# Altium project MCU_Board.PrjPcb
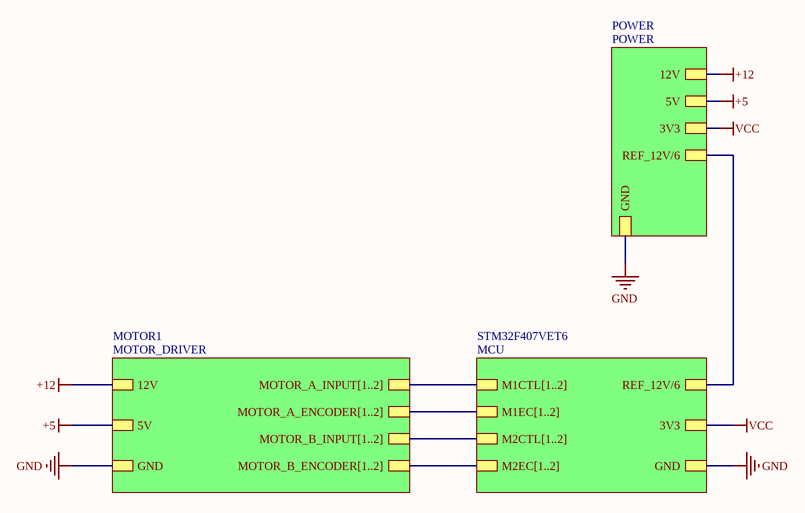
[diagram p0: TOP.SchDoc]
4 sheets, 67 parts. Net scope: hierarchical (ports join the sheet entries above them; power ports are global).
Board file: PCB1.PcbDoc
Sheets:
  TOP.SchDoc
    POWER = POWER.SchDoc
    STM32F407VET6 = MCU.SchDoc
    MOTOR1 = MOTOR_DRIVER.SchDoc

## Sheet TOP.SchDoc
size A4; SheetNumber: 1; SheetTotal: 4

### Sub-sheets
MOTOR1 = MOTOR_DRIVER: 12V, GND, MOTOR_A_INPUT[1..2], MOTOR_A_ENCODER[1..2], 5V, MOTOR_B_ENCODER[1..2], MOTOR_B_INPUT[1..2]
POWER = POWER: 12V, 5V, 3V3, GND, REF_12V/6
STM32F407VET6 = MCU: 3V3, GND, M1CTL[1..2], M1EC[1..2], M2CTL[1..2], M2EC[1..2], REF_12V/6

### Nets
+5: sheet POWER/5V, sheet MOTOR1/5V
+12: sheet POWER/12V, sheet MOTOR1/12V
GND: sheet POWER/GND, sheet STM32F407VET6/GND, sheet MOTOR1/GND
VCC: sheet POWER/3V3, sheet STM32F407VET6/3V3
REF_12V/6: sheet POWER/REF_12V/6, sheet STM32F407VET6/REF_12V/6

### Buses and harness runs
bus sheet MOTOR1/MOTOR_A_ENCODER[1..2] = sheet STM32F407VET6/M1EC[1..2]
bus sheet MOTOR1/MOTOR_A_INPUT[1..2] = sheet STM32F407VET6/M1CTL[1..2]
bus sheet MOTOR1/MOTOR_B_ENCODER[1..2] = sheet STM32F407VET6/M2EC[1..2]
bus sheet MOTOR1/MOTOR_B_INPUT[1..2] = sheet STM32F407VET6/M2CTL[1..2]

## Sheet POWER.SchDoc
size 203 x 127 mm; SheetNumber: 2; SheetTotal: 4
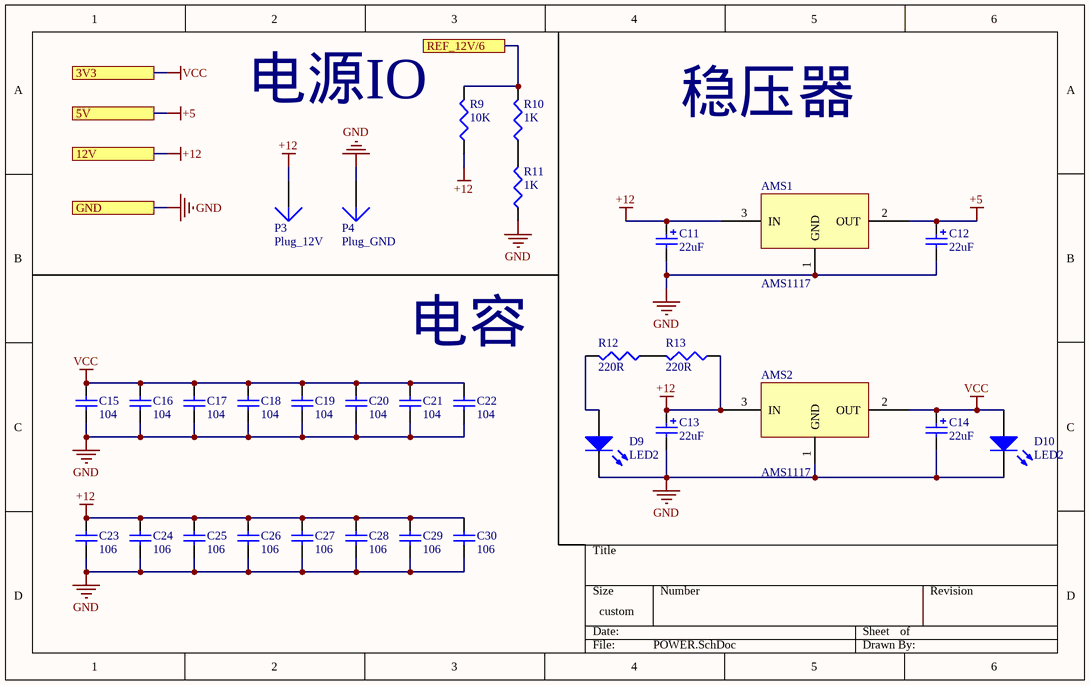
[diagram p1: POWER.SchDoc]

### Parts
AMS1  AMS1117  [AMS1117]
AMS2  AMS1117  [AMS1117]
C11  22uF  [MY0805]
C12  22uF  [MY0805]
C13  22uF  [MY0805]
C14  22uF  [MY0805]
C15  104  [MY0805]
C16  104  [MY0805]
C17  104  [MY0805]
C18  104  [MY0805]
C19  104  [MY0805]
C20  104  [MY0805]
C21  104  [MY0805]
C22  104  [MY0805]
C23  106  [MY0805]
C24  106  [MY0805]
C25  106  [MY0805]
C26  106  [MY0805]
C27  106  [MY0805]
C28  106  [MY0805]
C29  106  [MY0805]
C30  106  [MY0805]
D9  LED2  [MY0805]
D10  LED2  [MY0805]
P3  Plug_12V  [Hole_3MM]
P4  Plug_GND  [Hole_3MM]
R9  10K  [MY0805]
R10  1K  [MY0805]
R11  1K  [MY0805]
R12  220R  [MY0805]
R13  220R  [MY0805]

### Ports
3V3, 5V, 12V, GND, REF_12V/6

### Nets
+5: AMS1.2(OUT) C12.1 ; port 5V
+12: AMS1.3(IN) AMS2.3(IN) C11.1 C13.1 C23.2 C24.2 C25.2 C26.2 C27.2 C28.2 C29.2 C30.2 P3.1 R9.1 R13.1 ; port 12V
GND: AMS1.1(GND) AMS2.1(GND) C11.2 C12.2 C13.2 C14.2 C15.1 C16.1 C17.1 C18.1 C19.1 C20.1 C21.1 C22.1 C23.1 C24.1 C25.1 C26.1 C27.1 C28.1 C29.1 C30.1 D9.2(K) D10.2(K) P4.1 R11.1 ; port GND
VCC: AMS2.2(OUT) C14.1 C15.2 C16.2 C17.2 C18.2 C19.2 C20.2 C21.2 C22.2 D10.1(A) ; port 3V3
REF_12V/6: R9.2 R10.2 ; port REF_12V/6
NetD9_1: D9.1(A) R12.2
NetR10_1: R10.1 R11.2
NetR12_1: R12.1 R13.2

### Notes on the sheet
- 电源IO
- 稳压器
- 电容

### Library data of the parts
C11-C14 = Cap Pol2: Polarized Capacitor (Axial); Published: 8-Jun-2000; LatestRevisionDate: 17-Jul-2002; LatestRevisionNote: Re-released for DXP Platform.; PackageReference: POLAR0.8; Publisher: Altium Limited; PackageDescription: Polarized Capacitor; 2 Leads; Value: 22uF
C15-C30 = Cap: Capacitor; Published: 8-Jun-2000; LatestRevisionDate: 17-Jul-2002; LatestRevisionNote: Re-released for DXP Platform.; PackageReference: RAD-0.3; Publisher: Altium Limited; PackageDescription: Radial Cap, Thru-Hole; 2 Leads; 0.3 in Pin Spacing
  C15-C22: Value: 104
  C23-C30: Value: 106
D9 D10 = LED2: Typical RED, GREEN, YELLOW, AMBER GaAs LED; Published: 8-Jun-2000; LatestRevisionDate: 17-Jul-2002; LatestRevisionNote: Re-released for DXP Platform.; PackageVersion: Feb-2002; PackageReference: 3.2X1.6X1.1; Publisher: Altium Limited; PackageDescription: SM LED; 2 Flat Leads
P3 P4 = Plug: LatestRevisionDate: 17-Jul-2002; LatestRevisionNote: Re-released for DXP Platform.; Publisher: Altium Limited
R9-R11 = Res3: Resistor; Published: 8-Jun-2000; LatestRevisionDate: 29-May-2009; LatestRevisionNote: IPC-7351 Footprint Added.; PackageReference: J1-0603; Publisher: Altium Limited; PackageDescription: Chip Resistor
  R9: Value: 10K
  R10 R11: Value: 1K
R12 R13 = Res3: Resistor; Value: 1K; Published: 8-Jun-2000; LatestRevisionDate: 29-May-2009; LatestRevisionNote: IPC-7351 Footprint Added.; PackageReference: J1-0603; Publisher: Altium Limited; PackageDescription: Chip Resistor

## Sheet MCU.SchDoc
size A4; SheetNumber: 4; SheetTotal: 4
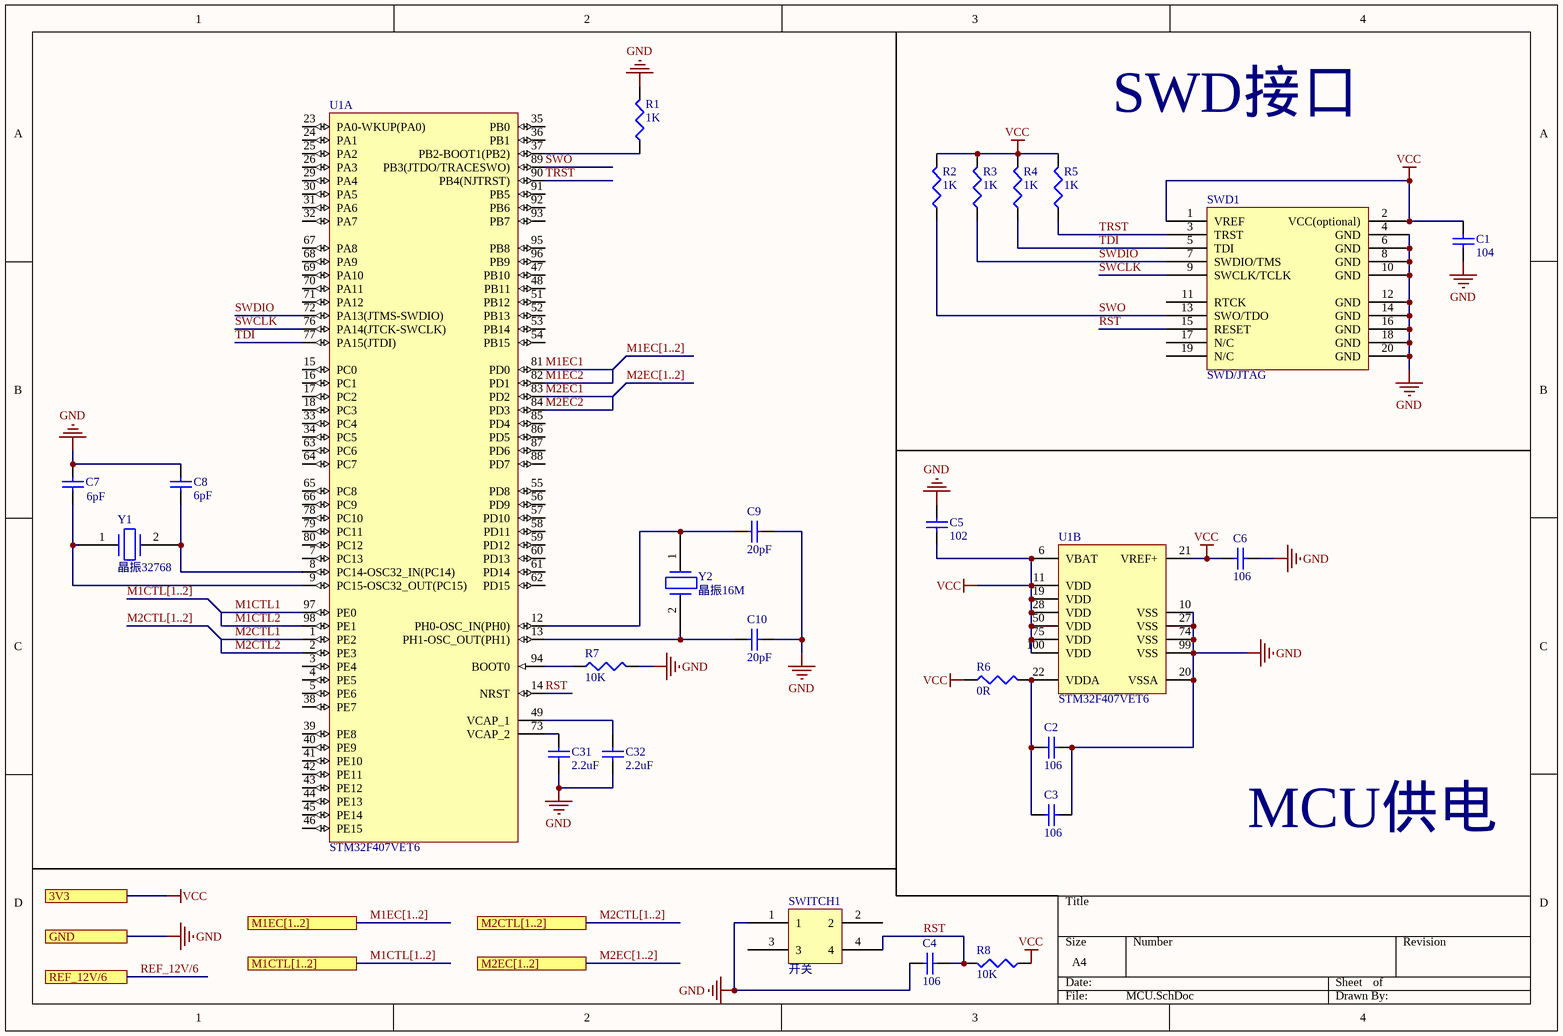
[diagram p2: MCU.SchDoc]

### Parts
C1  104  [MY0805]
C2  106  [MY0805]
C3  106  [MY0805]
C4  106  [MY0805]
C5  102  [MY0805]
C6  106  [MY0805]
C7  6pF  [MY0805]
C8  6pF  [MY0805]
C9  20pF  [MY0805]
C10  20pF  [MY0805]
C31  2.2uF  [MY0805]
C32  2.2uF  [MY0805]
R1  1K  [MY0805]
R2  1K  [MY0805]
R3  1K  [MY0805]
R4  1K  [MY0805]
R5  1K  [MY0805]
R6  0R  [MY0805]
R7  10K  [MY0805]
R8  10K  [MY0805]
SWD1  SWD/JTAG  [SWD]
SWITCH1  开关  [开关]
U1  STM32F407VET6  [STM-LQFP100_N]  (parts A,B of 2)
Y1  晶振32768  [晶振32768K_AT38]
Y2  晶振16M  [晶振16M]

### Ports
3V3, GND, M1CTL[1..2], M1EC[1..2], M2CTL[1..2], M2EC[1..2], REF_12V/6

### Nets
GND: C1.1 C2.2 C3.2 C4.1 C5.1 C6.2 C7.2 C8.2 C9.2 C10.2 C31.1 C32.1 R1.2 R7.2 SWD1.4(GND) SWD1.6(GND) SWD1.8(GND) SWD1.10(GND) SWD1.12(GND) SWD1.14(GND) SWD1.16(GND) SWD1.18(GND) SWD1.20(GND) SWITCH1.1 U1.10(VSS) U1.20(VSSA) U1.27(VSS) U1.74(VSS) U1.99(VSS) ; port GND
VCC: C1.2 C5.2 C6.1 R2.2 R3.2 R4.2 R5.2 R6.1 R8.1 SWD1.1(VREF) SWD1.2(VCC(optional)) U1.6(VBAT) U1.11(VDD) U1.19(VDD) U1.21(VREF+) U1.28(VDD) U1.50(VDD) U1.75(VDD) U1.100(VDD) ; port 3V3
M1CTL1: U1.97(PE0)
M1CTL2: U1.98(PE1)
M1EC1: U1.81(PD0)
M1EC2: U1.82(PD1)
M2CTL1: U1.1(PE2)
M2CTL2: U1.2(PE3)
M2EC1: U1.83(PD2)
M2EC2: U1.84(PD3)
RST: C4.2 R8.2 SWD1.15(RESET) SWITCH1.4 U1.14(NRST)
SWCLK: SWD1.9(SWCLK/TCLK) U1.76(PA14(JTCK-SWCLK))
SWDIO: R3.1 SWD1.7(SWDIO/TMS) U1.72(PA13(JTMS-SWDIO))
SWO: R2.1 SWD1.13(SWO/TDO) U1.89(PB3(JTDO/TRACESWO))
TDI: R4.1 SWD1.5(TDI) U1.77(PA15(JTDI))
TRST: R5.1 SWD1.3(TRST) U1.90(PB4(NJTRST))
NetC2_1: C2.1 C3.1 R6.2 U1.22(VDDA)
NetC7_1: C7.1 U1.9(PC15-OSC32_OUT(PC15)) Y1.1
NetC8_1: C8.1 U1.8(PC14-OSC32_IN(PC14)) Y1.2
NetC9_1: C9.1 U1.12(PH0-OSC_IN(PH0)) Y2.1
NetC10_1: C10.1 U1.13(PH1-OSC_OUT(PH1)) Y2.2
NetC31_2: C31.2 U1.73(VCAP_2)
NetC32_2: C32.2 U1.49(VCAP_1)
NetR1_1: R1.1 U1.37(PB2-BOOT1(PB2))
NetR7_1: R7.1 U1.94(BOOT0)

Not connected (* = marked no-connect by the designer): SWD1 11(RTCK) 17(N/C) 19(N/C); SWITCH1 2 3; U1 3(PE4) 4(PE5) 5(PE6) 7(PC13) 15(PC0) 16(PC1) 17(PC2) 18(PC3) 23(PA0-WKUP(PA0)) 24(PA1) 25(PA2) 26(PA3) 29(PA4) 30(PA5) 31(PA6) 32(PA7) 33(PC4) 34(PC5) 35(PB0) 36(PB1) 38(PE7) 39(PE8) 40(PE9) 41(PE10) 42(PE11) 43(PE12) 44(PE13) 45(PE14) 46(PE15) 47(PB10) 48(PB11) 51(PB12) 52(PB13) 53(PB14) 54(PB15) 55(PD8) 56(PD9) 57(PD10) 58(PD11) 59(PD12) 60(PD13) 61(PD14) 62(PD15) 63(PC6) 64(PC7) 65(PC8) 66(PC9) 67(PA8) 68(PA9) 69(PA10) 70(PA11) 71(PA12) 78(PC10) 79(PC11) 80(PC12) 85(PD4) 86(PD5) 87(PD6) 88(PD7) 91(PB5) 92(PB6) 93(PB7) 95(PB8) 96(PB9)

### Buses and harness runs
bus M1CTL[1..2]
bus M1CTL[1..2] = port M1CTL[1..2]
bus M1EC[1..2]
bus M1EC[1..2] = port M1EC[1..2]
bus M2CTL[1..2]
bus M2CTL[1..2] = port M2CTL[1..2]
bus M2EC[1..2]
bus M2EC[1..2] = port M2EC[1..2]

### Notes on the sheet
- SWD接口
- MCU供电

### Library data of the parts
C1-C6 C9 C10 C31 C32 = Cap: Capacitor; Published: 8-Jun-2000; LatestRevisionDate: 17-Jul-2002; LatestRevisionNote: Re-released for DXP Platform.; PackageReference: RAD-0.3; Publisher: Altium Limited; PackageDescription: Radial Cap, Thru-Hole; 2 Leads; 0.3 in Pin Spacing
  C1: Value: 104
  C2-C4 C6: Value: 106
  C5: Value: 102
  C9 C10: Value: 20PF
  C31 C32: Value: 2.2uF
C7 C8 = Cap: Capacitor; Value: 20PF; Published: 8-Jun-2000; LatestRevisionDate: 17-Jul-2002; LatestRevisionNote: Re-released for DXP Platform.; PackageReference: RAD-0.3; Publisher: Altium Limited; PackageDescription: Radial Cap, Thru-Hole; 2 Leads; 0.3 in Pin Spacing
R1-R8 = Res3: Resistor; Published: 8-Jun-2000; LatestRevisionDate: 29-May-2009; LatestRevisionNote: IPC-7351 Footprint Added.; PackageReference: J1-0603; Publisher: Altium Limited; PackageDescription: Chip Resistor
  R1-R5: Value: 1K
  R6: Value: 0R
  R7 R8: Value: 10K
U1 = STM32F407VET6: ARM Cortex-M4 32-bit MCU+FPU, 210 DMIPS, 512 kB Flash, 192 kB Internal RAM, 82 I/Os, 100-pin LQFP, -40 to 85 degC, Tray; Manufacturer: STMicroelectronics; D/A Converter: 2x12-bit; FLASH Size (Prog) (kB): 512; I/Os (High Current): 82; Internal RAM Size (kB): 192; Operating Frequency(F) (Processor speed) (MHz): 168; Supply Voltage(Vcc) max (V): 3.6; Supply Voltage(Vcc) min (V): 1.8; DatasheetVersion: Rev. 4; PackageVersion: Rev. 1, 06/2013; PackageReference: LQFP100; PackageDescription: 100-Pin Low Profile Quad Flat Package, 14 x 14 mm Body, 0.5 mm Pitch; Supplier 1: Digi-Key; Supplier Part Number 1: 497-12075-ND; Supplier 2: Farnell; Supplier Part Number 2: 2064367; Supplier 3: Newark; Supplier Part Number 3: 73T2332; Supplier 4: Mouser; Supplier Part Number 4: 511-STM32F407VET6; Core: ARM Cortex-M4; Packing: Tray; Mounting Technology: Surface Mount; PartNumber: STM32F407VET6; ComponentLink1Description: Manufacturer URL; ComponentLink1URL: http://www.st.com/web/en/home.html; ComponentLink2Description: Datasheet; ComponentLink2URL: http://www.st.com/st-web-ui/static/active/en/resource/technical/document/datasheet/DM00037051.pdf; ComponentLink3Description: Package Specification; ComponentLink3URL: http://www.st.com/st-web-ui/static/active/en/resource/technical/document/data_brief/DM00071938.pdf
Y1 Y2 = 晶振

## Sheet MOTOR_DRIVER.SchDoc
size A4; SheetNumber: 3; SheetTotal: 4
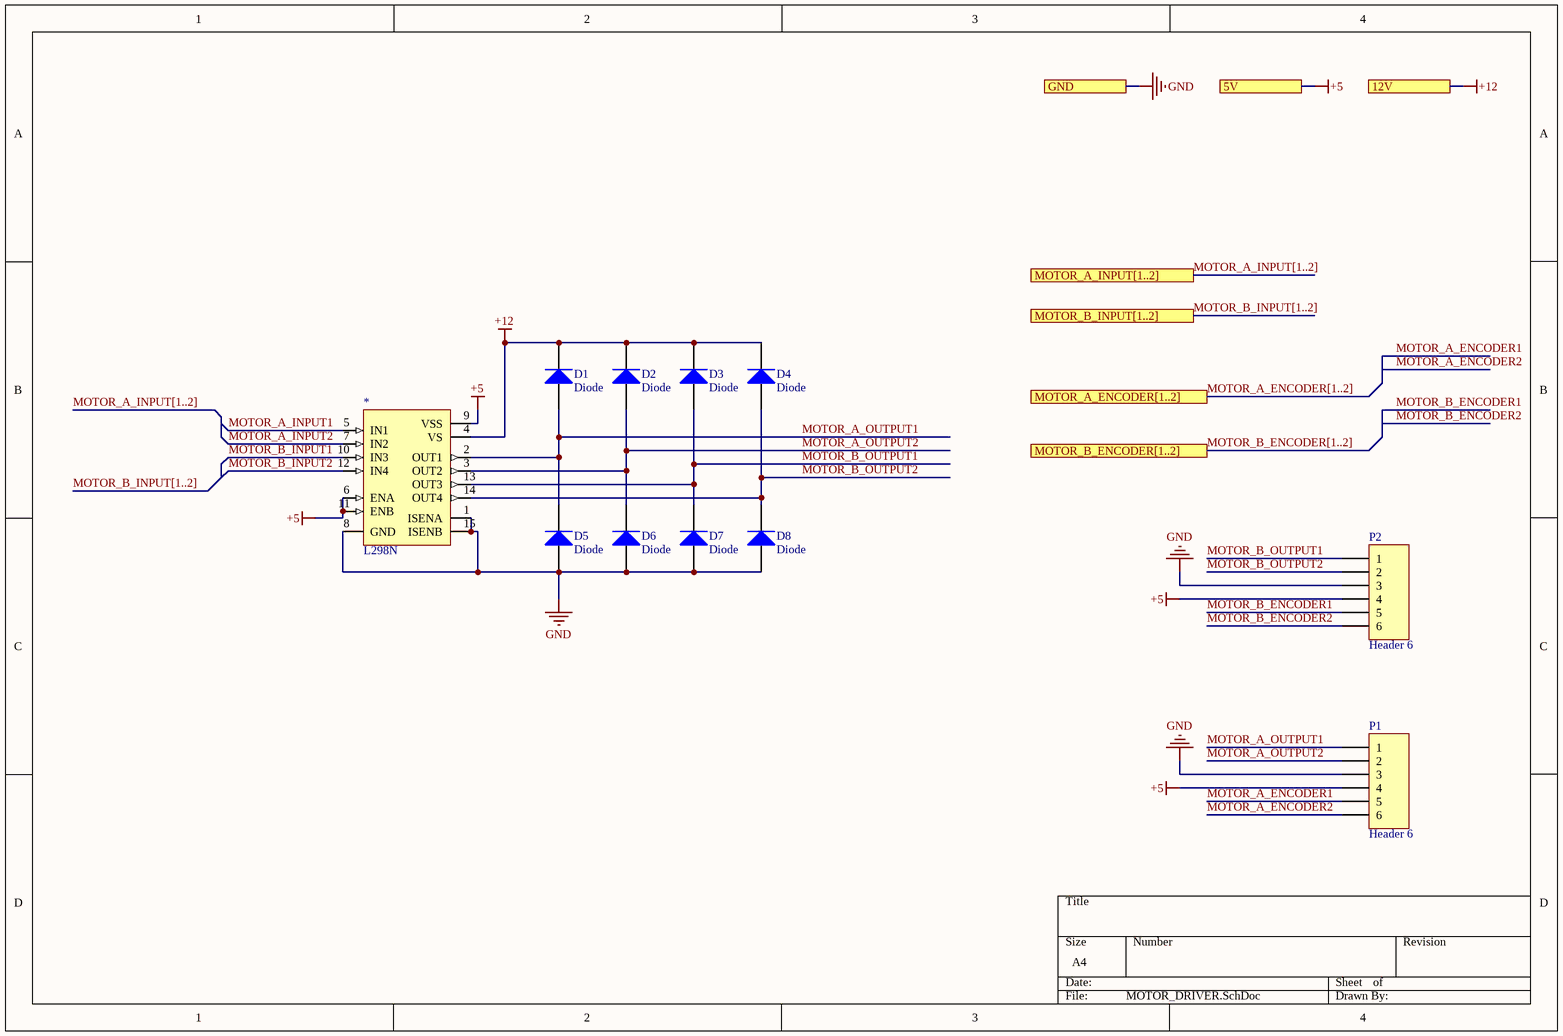
[diagram p3: MOTOR_DRIVER.SchDoc]

### Parts
*  L298N  [L298N-DIP]
D1  Diode  [MY0805]
D2  Diode  [MY0805]
D3  Diode  [MY0805]
D4  Diode  [MY0805]
D5  Diode  [MY0805]
D6  Diode  [MY0805]
D7  Diode  [MY0805]
D8  Diode  [MY0805]
P1  Header 6  [HDR1X6]
P2  Header 6  [HDR1X6]

### Ports
5V, 12V, GND, MOTOR_A_ENCODER[1..2], MOTOR_A_INPUT[1..2], MOTOR_B_ENCODER[1..2], MOTOR_B_INPUT[1..2]

### Nets
+5: *.6(ENA) *.9(VSS) *.11(ENB) P1.4 P2.4 ; port 5V
+12: *.4(VS) D1.2(K) D2.2(K) D3.2(K) D4.2(K) ; port 12V
GND: *.1(ISENA) *.8(GND) *.15(ISENB) D5.1(A) D6.1(A) D7.1(A) D8.1(A) P1.3 P2.3 ; port GND
MOTOR_A_ENCODER1: P1.5  [project net M1EC1]
MOTOR_A_ENCODER2: P1.6  [project net M1EC2]
MOTOR_A_INPUT1: *.5(IN1)  [project net M1CTL1]
MOTOR_A_INPUT2: *.7(IN2)  [project net M1CTL2]
MOTOR_A_OUTPUT1: *.2(OUT1) D1.1(A) D5.2(K) P1.1
MOTOR_A_OUTPUT2: *.3(OUT2) D2.1(A) D6.2(K) P1.2
MOTOR_B_ENCODER1: P2.5  [project net M2EC1]
MOTOR_B_ENCODER2: P2.6  [project net M2EC2]
MOTOR_B_INPUT1: *.10(IN3)  [project net M2CTL1]
MOTOR_B_INPUT2: *.12(IN4)  [project net M2CTL2]
MOTOR_B_OUTPUT1: *.13(OUT3) D3.1(A) D7.2(K) P2.1
MOTOR_B_OUTPUT2: *.14(OUT4) D4.1(A) D8.2(K) P2.2

### Buses and harness runs
bus MOTOR_A_ENCODER[1..2] = port MOTOR_A_ENCODER[1..2]
bus MOTOR_A_INPUT[1..2]
bus MOTOR_A_INPUT[1..2] = port MOTOR_A_INPUT[1..2]
bus MOTOR_B_ENCODER[1..2] = port MOTOR_B_ENCODER[1..2]
bus MOTOR_B_INPUT[1..2]
bus MOTOR_B_INPUT[1..2] = port MOTOR_B_INPUT[1..2]

### Library data of the parts
D1-D8 = Diode: Default Diode; Published: 8-Jun-2000; LatestRevisionDate: 17-Jul-2002; LatestRevisionNote: Re-released for DXP Platform.; PackageVersion: Sep-1996; PackageReference: SMC; Publisher: Altium Limited; PackageDescription: DO-214-AB/SMC; 2 C-Bend Leads; Body 7.9 x 5.9 mm, inc. leads (LxW); Code_JEDEC: DO-214-AB
P1 P2 = Header 6: Header, 6-Pin; LatestRevisionDate: 17-Jul-2002; LatestRevisionNote: Re-released for DXP Platform.; Publisher: Altium Limited

## Nets that join several sheets
+5: POWER (AMS1.2 C12.1), MOTOR_DRIVER (5 pins)
+12: POWER (15 pins), MOTOR_DRIVER (5 pins)
GND: POWER (26 pins), MCU (29 pins), MOTOR_DRIVER (9 pins)
VCC: POWER (11 pins), MCU (19 pins)
M1CTL1: MCU (U1.97), MOTOR_DRIVER (*.5)
M1CTL2: MCU (U1.98), MOTOR_DRIVER (*.7)
M1EC1: MCU (U1.81), MOTOR_DRIVER (P1.5)
M1EC2: MCU (U1.82), MOTOR_DRIVER (P1.6)
M2CTL1: MCU (U1.1), MOTOR_DRIVER (*.10)
M2CTL2: MCU (U1.2), MOTOR_DRIVER (*.12)
M2EC1: MCU (U1.83), MOTOR_DRIVER (P2.5)
M2EC2: MCU (U1.84), MOTOR_DRIVER (P2.6)